# EAGLE design lcd20x4_keyboard (EAGLE 7.2.0)
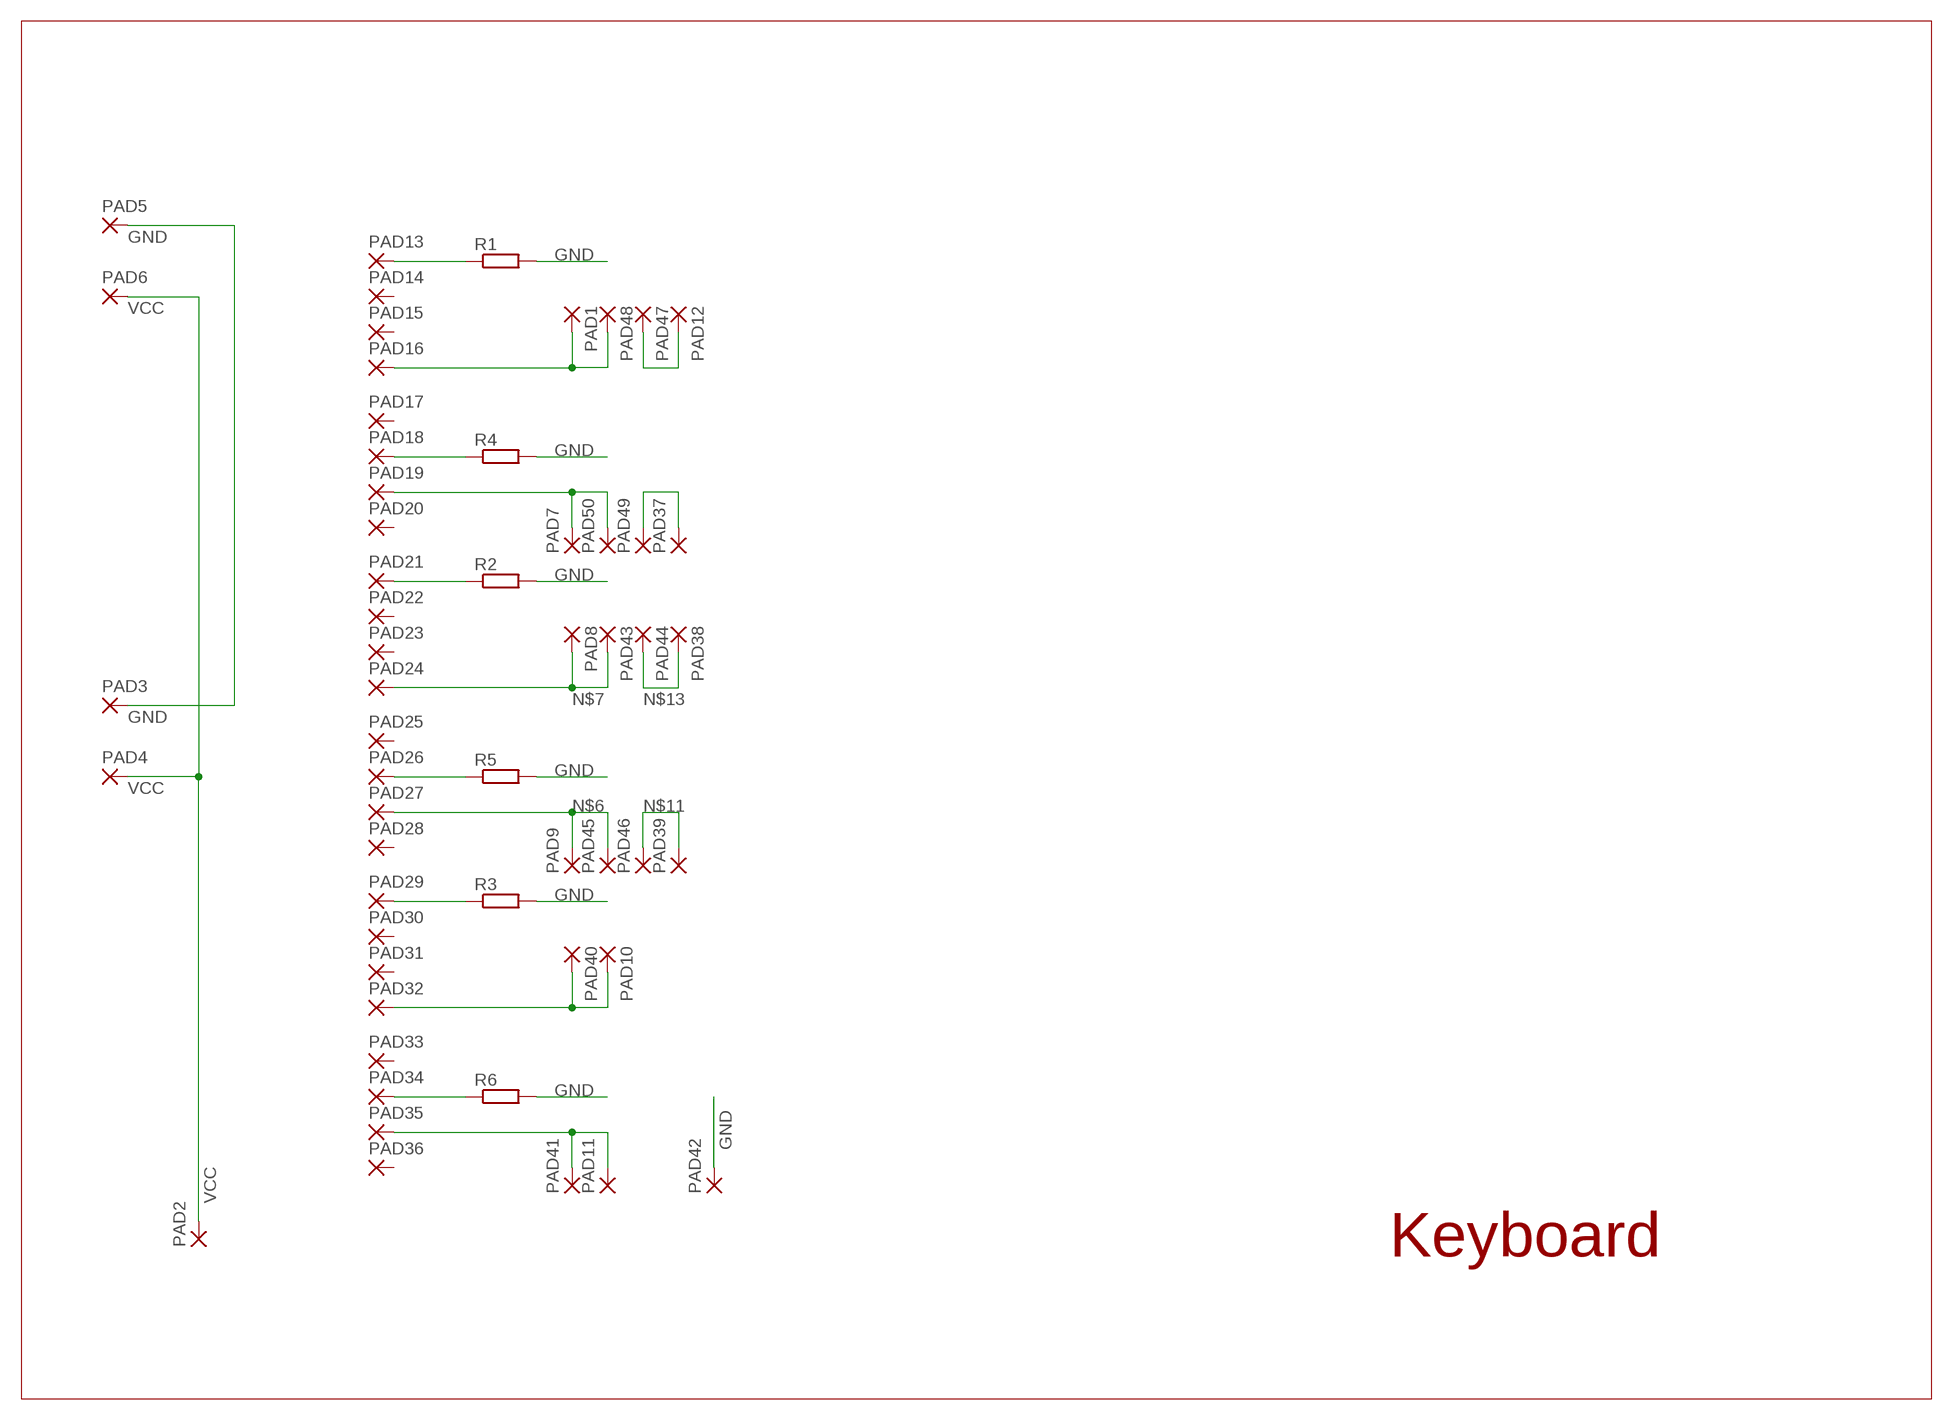
[diagram p0: schematic, sheet 1]

## Parts
PAD1  WIREPAD1,6/0,8  [1,6/0,8]
PAD2  WIREPAD1,6/0,8  [1,6/0,8]
PAD3  WIREPAD1,6/0,8  [1,6/0,8]
PAD4  WIREPAD1,6/0,8  [1,6/0,8]
PAD5  WIREPAD1,6/0,8  [1,6/0,8]
PAD6  WIREPAD1,6/0,8  [1,6/0,8]
PAD7  WIREPAD1,6/0,8  [1,6/0,8]
PAD8  WIREPAD1,6/0,8  [1,6/0,8]
PAD9  WIREPAD1,6/0,8  [1,6/0,8]
PAD10  WIREPAD1,6/0,8  [1,6/0,8]
PAD11  WIREPAD1,6/0,8  [1,6/0,8]
PAD12  WIREPAD1,6/0,8  [1,6/0,8]
PAD13  WIREPAD1,6/0,8  [1,6/0,8]
PAD14  WIREPAD1,6/0,8  [1,6/0,8]
PAD15  WIREPAD1,6/0,8  [1,6/0,8]
PAD16  WIREPAD1,6/0,8  [1,6/0,8]
PAD17  WIREPAD1,6/0,8  [1,6/0,8]
PAD18  WIREPAD1,6/0,8  [1,6/0,8]
PAD19  WIREPAD1,6/0,8  [1,6/0,8]
PAD20  WIREPAD1,6/0,8  [1,6/0,8]
PAD21  WIREPAD1,6/0,8  [1,6/0,8]
PAD22  WIREPAD1,6/0,8  [1,6/0,8]
PAD23  WIREPAD1,6/0,8  [1,6/0,8]
PAD24  WIREPAD1,6/0,8  [1,6/0,8]
PAD25  WIREPAD1,6/0,8  [1,6/0,8]
PAD26  WIREPAD1,6/0,8  [1,6/0,8]
PAD27  WIREPAD1,6/0,8  [1,6/0,8]
PAD28  WIREPAD1,6/0,8  [1,6/0,8]
PAD29  WIREPAD1,6/0,8  [1,6/0,8]
PAD30  WIREPAD1,6/0,8  [1,6/0,8]
PAD31  WIREPAD1,6/0,8  [1,6/0,8]
PAD32  WIREPAD1,6/0,8  [1,6/0,8]
PAD33  WIREPAD1,6/0,8  [1,6/0,8]
PAD34  WIREPAD1,6/0,8  [1,6/0,8]
PAD35  WIREPAD1,6/0,8  [1,6/0,8]
PAD36  WIREPAD1,6/0,8  [1,6/0,8]
PAD37  WIREPAD1,6/0,8  [1,6/0,8]
PAD38  WIREPAD1,6/0,8  [1,6/0,8]
PAD39  WIREPAD1,6/0,8  [1,6/0,8]
PAD40  WIREPAD1,6/0,8  [1,6/0,8]
PAD41  WIREPAD1,6/0,8  [1,6/0,8]
PAD42  WIREPAD1,6/0,8  [1,6/0,8]
PAD43  WIREPAD1,6/0,8  [1,6/0,8]
PAD44  WIREPAD1,6/0,8  [1,6/0,8]
PAD45  WIREPAD1,6/0,8  [1,6/0,8]
PAD46  WIREPAD1,6/0,8  [1,6/0,8]
PAD47  WIREPAD1,6/0,8  [1,6/0,8]
PAD48  WIREPAD1,6/0,8  [1,6/0,8]
PAD49  WIREPAD1,6/0,8  [1,6/0,8]
PAD50  WIREPAD1,6/0,8  [1,6/0,8]
R1  R-EU_M0805  [M0805]
R2  R-EU_M0805  [M0805]
R3  R-EU_M0805  [M0805]
R4  R-EU_M0805  [M0805]
R5  R-EU_M0805  [M0805]
R6  R-EU_M0805  [M0805]

## Nets
GND: PAD3.1(P) PAD5.1(P) PAD42.1(P) R1.2 R2.2 R3.2 R4.2 R5.2 R6.2
N$1: PAD29.1(P) R3.1
N$2: PAD21.1(P) R2.1
N$3: PAD13.1(P) R1.1
N$4: PAD10.1(P) PAD32.1(P) PAD40.1(P)
N$5: PAD11.1(P) PAD35.1(P) PAD41.1(P)
N$6: PAD9.1(P) PAD27.1(P) PAD45.1(P)
N$7: PAD8.1(P) PAD24.1(P) PAD43.1(P)
N$8: PAD1.1(P) PAD16.1(P) PAD48.1(P)
N$9: PAD7.1(P) PAD19.1(P) PAD50.1(P)
N$10: PAD34.1(P) R6.1
N$11: PAD39.1(P) PAD46.1(P)
N$12: PAD26.1(P) R5.1
N$13: PAD38.1(P) PAD44.1(P)
N$14: PAD18.1(P) R4.1
N$15: PAD37.1(P) PAD49.1(P)
N$16: PAD12.1(P) PAD47.1(P)
VCC: PAD2.1(P) PAD4.1(P) PAD6.1(P)
Unconnected: PAD14.1(P) PAD15.1(P) PAD17.1(P) PAD20.1(P) PAD22.1(P) PAD23.1(P) PAD25.1(P) PAD28.1(P) PAD30.1(P) PAD31.1(P) PAD33.1(P) PAD36.1(P)

## Notes on the sheet
- Keyboard

## Library data of the parts
PAD1-PAD50 = wirepad:WIREPAD: Wire PAD connect wire on PCB
R1-R6 = rcl:R-EU_: RESISTOR, European symbol

## Board
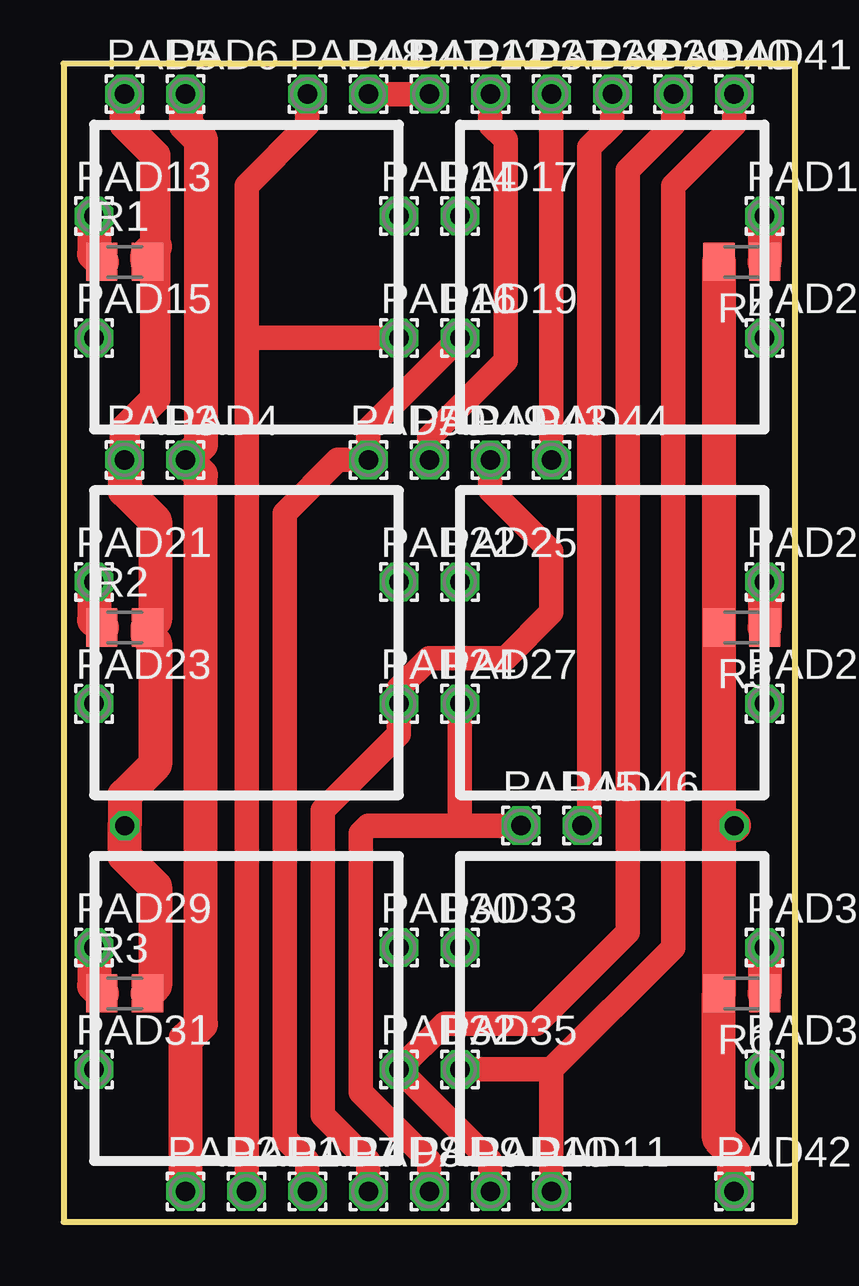
[diagram p1: board, top side]
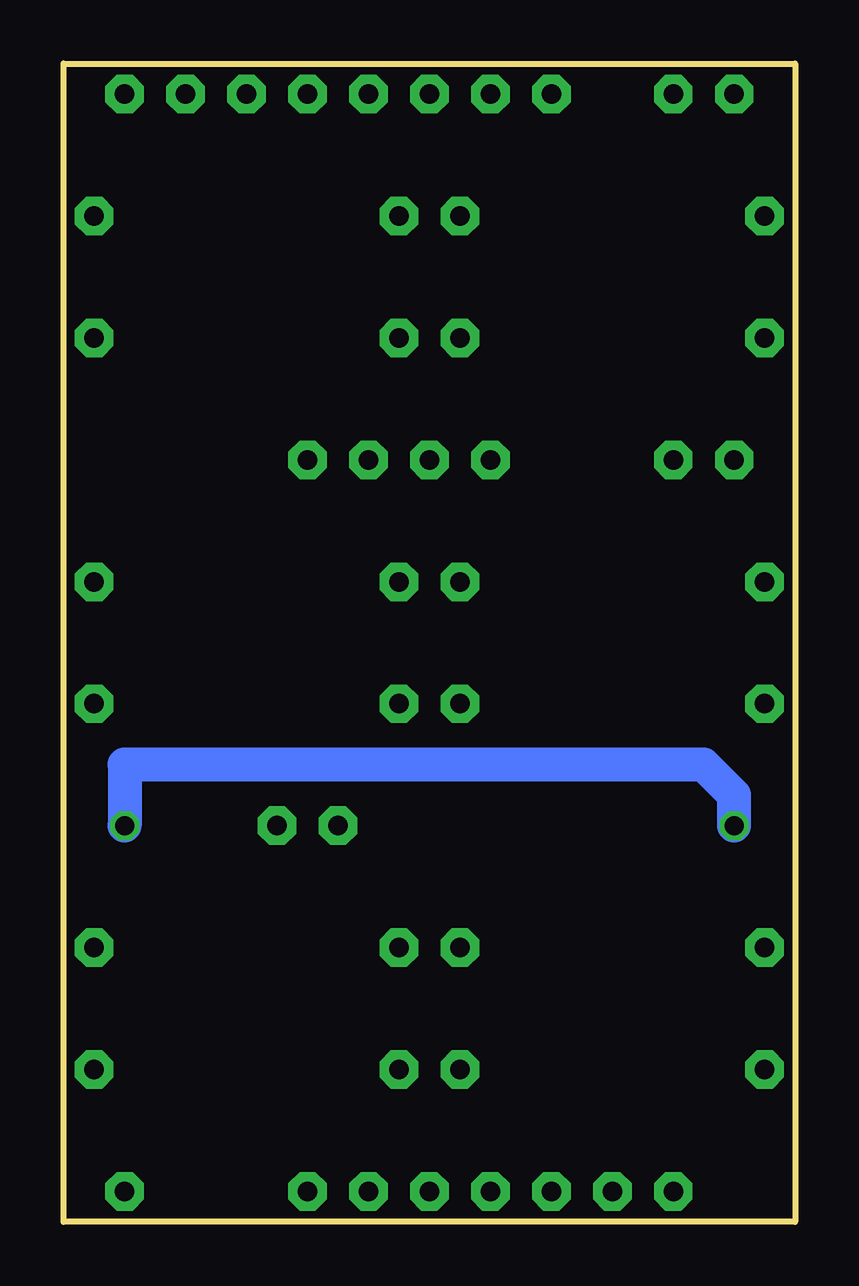
[diagram p2: board, bottom side, seen from below]

Size 30.48 x 48.26 mm. Coordinates in mm from the lower left corner, seen from the top.
Outline: 0,0 30.48,0 30.48,48.26 0,48.26 0,0
Copper layers (1*16): Top 0.035mm / dielectric 1.5mm / Bottom 0.035mm
Design rules "default": minimum track width 10mil, minimum drill 24mil, track to track 8mil, track to pad 8mil, pad to pad 8mil, via to via 8mil, smd to smd 8mil, copper to edge 40mil, drill to drill 8mil, minimum pad ring 10mil, minimum via ring 8mil, stop-mask expansion 4mil, vias tented up to drill 0mil, thermal gap 10mil

### Footprints (pad centres in the part's own frame; a part is rotated, then mirrored left to right if it is on the bottom)
1,6/0,8 = drill 0.813 pad 1.6 octagon: 1 0,0
M0805 = smd 1.3 x 1.6: 1 -0.95,0; 2 0.95,0

### Placement (x,y rotation side)
PAD1  7.62,1.27 0 top
PAD2  5.08,1.27 0 top
PAD3  2.54,31.75 0 top
PAD4  5.08,31.75 0 top
PAD5  2.54,46.99 0 top
PAD6  5.08,46.99 0 top
PAD7  10.16,1.27 0 top
PAD8  12.7,1.27 0 top
PAD9  15.24,1.27 0 top
PAD10  17.78,1.27 0 top
PAD11  20.32,1.27 0 top
PAD12  15.24,46.99 0 top
PAD13  1.27,41.91 0 top
PAD14  13.97,41.91 0 top
PAD15  1.27,36.83 0 top
PAD16  13.97,36.83 0 top
PAD17  16.51,41.91 0 top
PAD18  29.21,41.91 0 top
PAD19  16.51,36.83 0 top
PAD20  29.21,36.83 0 top
PAD21  1.27,26.67 0 top
PAD22  13.97,26.67 0 top
PAD23  1.27,21.59 0 top
PAD24  13.97,21.59 0 top
PAD25  16.51,26.67 0 top
PAD26  29.21,26.67 0 top
PAD27  16.51,21.59 0 top
PAD28  29.21,21.59 0 top
PAD29  1.27,11.43 0 top
PAD30  13.97,11.43 0 top
PAD31  1.27,6.35 0 top
PAD32  13.97,6.35 0 top
PAD33  16.51,11.43 0 top
PAD34  29.21,11.43 0 top
PAD35  16.51,6.35 0 top
PAD36  29.21,6.35 0 top
PAD37  17.78,46.99 0 top
PAD38  20.32,46.99 0 top
PAD39  22.86,46.99 0 top
PAD40  25.4,46.99 0 top
PAD41  27.94,46.99 0 top
PAD42  27.94,1.27 0 top
PAD43  17.78,31.75 0 top
PAD44  20.32,31.75 0 top
PAD45  19.05,16.51 0 top
PAD46  21.59,16.51 0 top
PAD47  12.7,46.99 0 top
PAD48  10.16,46.99 0 top
PAD49  15.24,31.75 0 top
PAD50  12.7,31.75 0 top
R1  2.54,40.01 0 top
R2  2.54,24.77 0 top
R3  2.54,9.53 0 top
R4  28.26,40.01 180 top
R5  28.26,24.77 180 top
R6  28.26,9.53 180 top

### Tracks (layer width: path | path; a pad name or v marks a point on that pad's centre or on a via)
GND  (via drill 0.8)
  Top 1.27: PAD5.1 2.54,45.72 3.81,44.45 3.81,40.64 3.81,34.29 2.54,33.02 PAD3.1
  Top 1.422: PAD3.1 2.54,30.48 3.81,29.21 3.81,25.09 R2.2 3.49,24.45 3.81,24.13 3.81,19.05 2.54,17.78 v2.54,16.51 2.54,15.24 3.81,13.97 3.81,9.85 R3.2 | R1.2 3.49,40.32 3.81,40.64 | PAD42.1 27.94,2.86 27.3,3.49 R6.2 27.31,16.51 | 27.31,16.51 R5.2 R4.2 | v27.94,16.51 27.31,16.51
  Bottom 1.422: v2.54,16.51 2.54,17.78 3.81,19.05 27.94,19.05 v27.94,16.51
N$1
  Top 1.422: PAD29.1 1.27,9.85 R3.1
N$2
  Top 1.422: PAD21.1 1.27,25.09 R2.1
N$3
  Top 1.422: PAD13.1 1.27,40.33 R1.1
N$4
  Top 1.016: PAD10.1 17.78,2.54 PAD32.1 15.88,8.26 19.68,8.26 23.5,12.06 23.5,43.81 25.4,45.72 PAD40.1
N$5
  Top 1.016: PAD35.1 20.32,6.35 | 20.32,6.35 25.4,11.43 25.4,43.18 27.94,45.72 PAD41.1 | PAD11.1 20.32,6.35
N$6
  Top 1.016: PAD9.1 15.24,2.54 12.38,5.4 12.38,16.19 12.7,16.51 16.51,16.51 | PAD45.1 16.51,16.51 | PAD27.1 16.51,16.51
N$7
  Top 1.016: PAD8.1 12.7,2.54 10.79,4.45 10.79,17.14 13.97,20.32 PAD24.1 13.97,22.23 15.24,23.5 18.41,23.5 20.32,25.4 20.32,27.94 17.78,30.48 PAD43.1
N$8
  Top 1.016: PAD1.1 7.62,36.83 | 7.62,36.83 7.62,43.18 10.16,45.72 PAD48.1 | PAD16.1 7.62,36.83
N$9
  Top 1.016: PAD7.1 10.16,2.54 9.21,3.49 9.21,29.53 11.43,31.75 PAD50.1 12.7,33.02 PAD19.1
N$10
  Top 1.422: PAD34.1 R6.1
N$11
  Top 1.016: PAD39.1 22.86,45.72 21.91,44.77 21.91,16.83 PAD46.1
N$12
  Top 1.422: PAD26.1 R5.1
N$13
  Top 1.016: PAD44.1 PAD38.1
N$14
  Top 1.422: PAD18.1 R4.1
N$15
  Top 1.016: PAD37.1 17.78,45.72 18.41,45.09 18.41,35.88 15.24,32.7 PAD49.1
N$16
  Top 1.016: PAD12.1 PAD47.1
VCC
  Top 1.422: PAD2.1 5.08,7.62 5.71,8.26 5.71,31.11 PAD4.1 5.71,32.38 5.71,45.09 5.08,45.72 PAD6.1